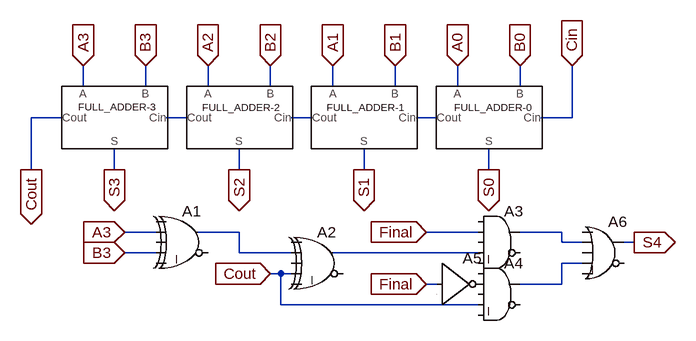
[diagram p0: schematic 4-Bit_Adder.asc]
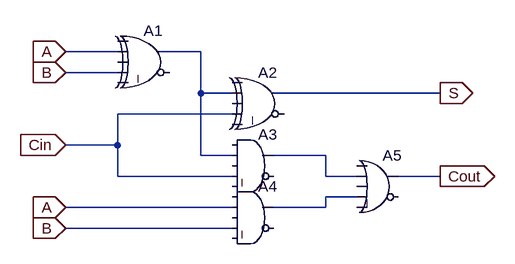
[diagram p1: sub-circuit full_adder.asc]
4-Bit_Adder.asc, the LTspice schematic file:
Version 4
SHEET 1 880 680
WIRE -96 64 -96 32
WIRE 0 64 0 32
WIRE 96 64 96 32
WIRE 192 64 192 32
WIRE 288 64 288 32
WIRE 384 64 384 32
WIRE 480 64 480 32
WIRE 576 64 576 32
WIRE -128 112 -176 112
WIRE 64 112 32 112
WIRE 256 112 224 112
WIRE 448 112 416 112
WIRE 656 112 656 32
WIRE 656 112 608 112
WIRE -176 192 -176 112
WIRE -48 192 -48 160
WIRE 144 192 144 160
WIRE 336 192 336 160
WIRE 528 192 528 160
WIRE 16 288 -32 288
WIRE 144 288 80 288
WIRE 512 288 432 288
WIRE 640 288 576 288
WIRE 640 304 640 288
WIRE 672 304 640 304
WIRE 752 304 736 304
WIRE 16 320 -32 320
WIRE 144 320 144 288
WIRE 224 320 144 320
WIRE 512 320 288 320
WIRE 672 336 640 336
WIRE 208 352 192 352
WIRE 224 352 208 352
WIRE 448 368 432 368
WIRE 640 368 640 336
WIRE 640 368 576 368
WIRE 208 400 208 352
WIRE 512 400 208 400
FLAG -96 32 A3
IOPIN -96 32 In
FLAG 0 32 B3
IOPIN 0 32 In
FLAG 96 32 A2
IOPIN 96 32 In
FLAG 192 32 B2
IOPIN 192 32 In
FLAG 288 32 A1
IOPIN 288 32 In
FLAG 384 32 B1
IOPIN 384 32 In
FLAG 480 32 A0
IOPIN 480 32 In
FLAG 576 32 B0
IOPIN 576 32 In
FLAG 656 32 Cin
IOPIN 656 32 In
FLAG -176 192 Cout
IOPIN -176 192 Out
FLAG -48 192 S3
IOPIN -48 192 Out
FLAG 144 192 S2
IOPIN 144 192 Out
FLAG 336 192 S1
IOPIN 336 192 Out
FLAG 528 192 S0
IOPIN 528 192 Out
FLAG -32 288 A3
IOPIN -32 288 In
FLAG -32 320 B3
IOPIN -32 320 In
FLAG 192 352 Cout
IOPIN 192 352 In
FLAG 432 288 Final
IOPIN 432 288 In
FLAG 432 368 Final
IOPIN 432 368 In
FLAG 752 304 S4
IOPIN 752 304 Out
SYMBOL Full_Adder 528 112 R0
WINDOW 0 -53 -16 Left 1
SYMATTR InstName FULL_ADDER-0
SYMBOL Full_Adder 336 112 R0
WINDOW 0 -57 -16 Left 1
SYMATTR InstName FULL_ADDER-1
SYMBOL Full_Adder 144 112 R0
WINDOW 0 -57 -16 Left 1
SYMATTR InstName FULL_ADDER-2
SYMBOL Full_Adder -48 112 R0
WINDOW 0 -56 -17 Left 1
SYMATTR InstName FULL_ADDER-3
SYMBOL Digital\\xor 64 240 R0
SYMATTR InstName A1
SYMBOL Digital\\xor 272 272 R0
SYMATTR InstName A2
SYMBOL Digital\\and 544 240 R0
SYMATTR InstName A3
SYMBOL Digital\\and 544 320 R0
SYMATTR InstName A4
SYMBOL Digital\\inv 448 304 R0
SYMATTR InstName A5
SYMBOL Digital\\or 704 256 R0
SYMATTR InstName A6

full_adder.asc, the sub-circuit schematic file:
Version 4
SHEET 1 880 680
WIRE 64 48 -16 48
WIRE 192 48 128 48
WIRE 64 80 -16 80
WIRE 192 112 192 48
WIRE 240 112 192 112
WIRE 560 112 304 112
WIRE 240 144 64 144
WIRE 64 192 64 144
WIRE 64 192 -16 192
WIRE 192 208 192 112
WIRE 240 208 192 208
WIRE 384 208 304 208
WIRE 64 240 64 192
WIRE 240 240 64 240
WIRE 384 240 384 208
WIRE 432 240 384 240
WIRE 560 240 496 240
WIRE 432 272 384 272
WIRE 240 288 -16 288
WIRE 384 288 384 272
WIRE 384 288 304 288
WIRE 240 320 -16 320
FLAG -16 48 A
IOPIN -16 48 In
FLAG -16 80 B
IOPIN -16 80 In
FLAG -16 192 Cin
IOPIN -16 192 In
FLAG -16 288 A
IOPIN -16 288 In
FLAG -16 320 B
IOPIN -16 320 In
FLAG 560 112 S
IOPIN 560 112 Out
FLAG 560 240 Cout
IOPIN 560 240 Out
SYMBOL Digital\\xor 112 0 R0
SYMATTR InstName A1
SYMBOL Digital\\xor 288 64 R0
SYMATTR InstName A2
SYMBOL Digital\\and 272 160 R0
SYMATTR InstName A3
SYMBOL Digital\\and 272 240 R0
SYMATTR InstName A4
SYMBOL Digital\\or 464 192 R0
SYMATTR InstName A5

The netlist it stands for:
* 4-Bit_Adder.asc
XFULL_ADDER-0 A0 B0 N003 Cin S0 full_adder
XFULL_ADDER-1 A1 B1 N002 N003 S1 full_adder
XFULL_ADDER-2 A2 B2 N001 N002 S2 full_adder
XFULL_ADDER-3 A3 B3 Cout N001 S3 full_adder
A1 0 A3 0 B3 0 0 N004 0 XOR
A2 0 N004 0 Cout 0 0 N006 0 XOR
A3 0 Final 0 N006 0 0 N005 0 AND
A4 0 P001 0 Cout 0 0 N007 0 AND
A5 Final 0 0 0 0 P001 0 0 BUF
A6 0 N005 0 N007 0 0 S4 0 OR

* block symbol definitions
.subckt full_adder A B Cout Cin S
A1 0 A 0 B 0 0 N001 0 XOR
A2 0 N001 0 Cin 0 0 S 0 XOR
A3 0 N001 0 Cin 0 0 N002 0 AND
A4 0 A 0 B 0 0 N003 0 AND
A5 0 N002 0 N003 0 0 Cout 0 OR
.ends full_adder

.backanno
.end